# Altium schematic sheet Top_Layer.SchDoc
size A4; SheetNumber: 1; SheetTotal: 10
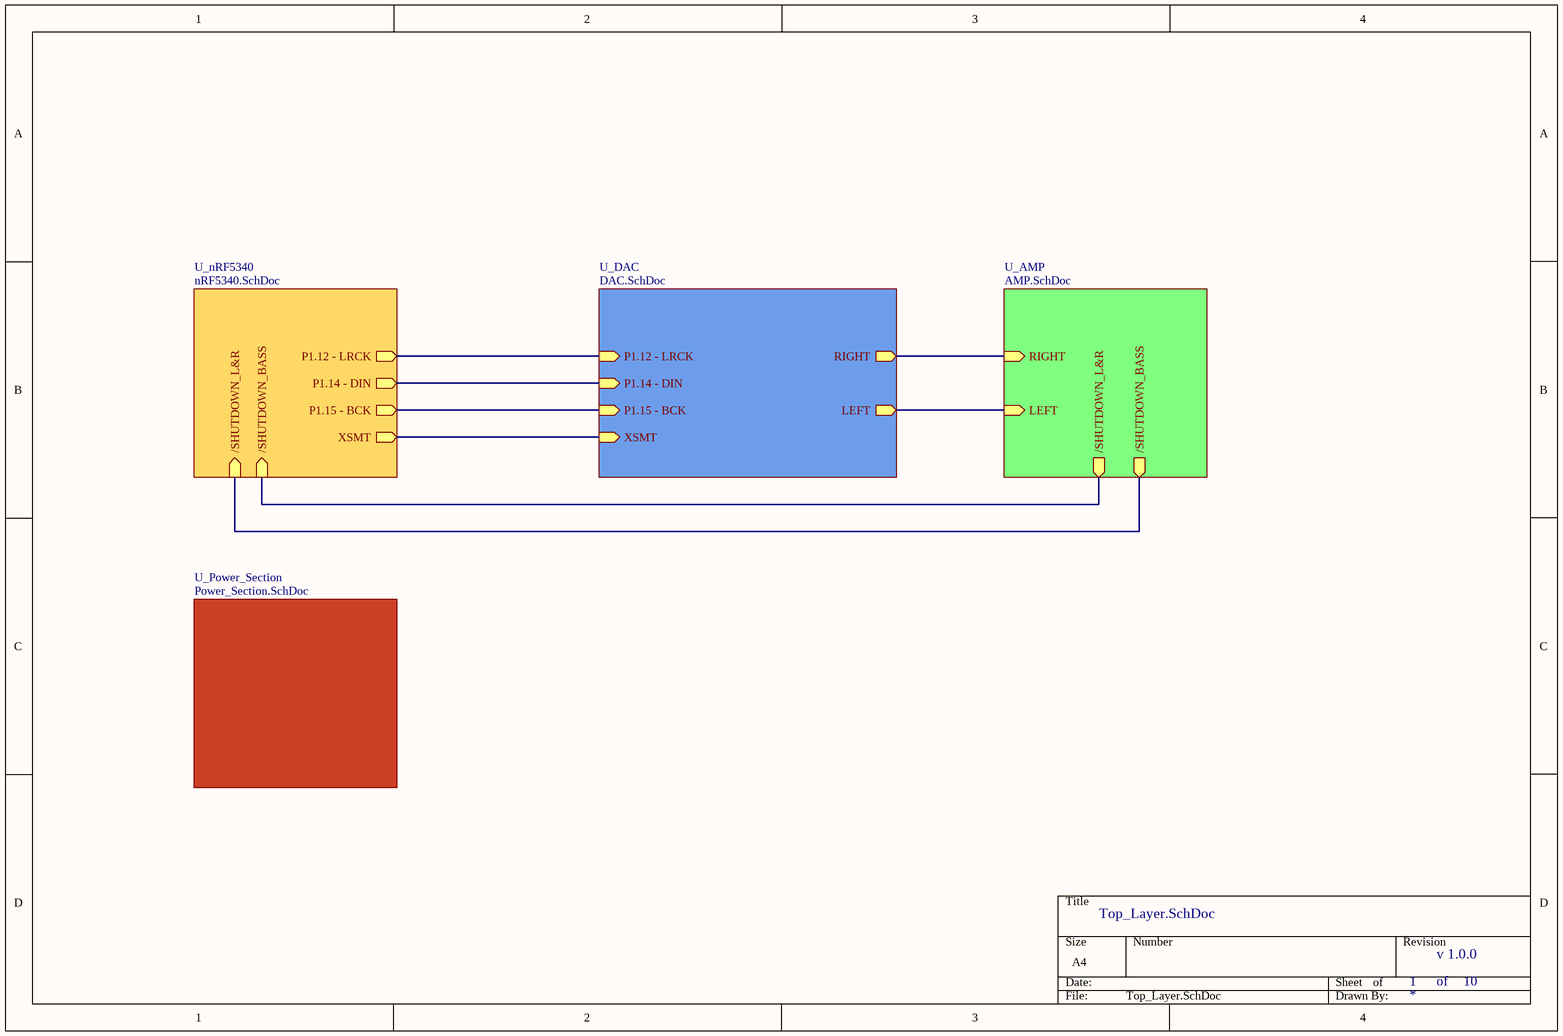
[diagram p0: Top_Layer.SchDoc]

## Sub-sheets
U_AMP = AMP.SchDoc: RIGHT (in), LEFT (in), /SHUTDOWN_L&R (out), /SHUTDOWN_BASS (out)
U_DAC = DAC.SchDoc: P1.15 - BCK (in), P1.14 - DIN (in), P1.12 - LRCK (in), LEFT (out), RIGHT (out), XSMT (in)
U_nRF5340 = nRF5340.SchDoc: P1.12 - LRCK (out), P1.14 - DIN (out), P1.15 - BCK (out), XSMT (out), /SHUTDOWN_L&R (in), /SHUTDOWN_BASS (in)
U_Power_Section = Power_Section.SchDoc: no entries

## Nets
(unnamed): sheet U_nRF5340/P1.12 - LRCK, sheet U_DAC/P1.12 - LRCK
(unnamed): sheet U_nRF5340/P1.14 - DIN, sheet U_DAC/P1.14 - DIN
(unnamed): sheet U_nRF5340/P1.15 - BCK, sheet U_DAC/P1.15 - BCK
(unnamed): sheet U_nRF5340/XSMT, sheet U_DAC/XSMT
(unnamed): sheet U_nRF5340//SHUTDOWN_L&R, sheet U_AMP//SHUTDOWN_BASS
(unnamed): sheet U_nRF5340//SHUTDOWN_BASS, sheet U_AMP//SHUTDOWN_L&R
(unnamed): sheet U_AMP/RIGHT, sheet U_DAC/RIGHT
(unnamed): sheet U_AMP/LEFT, sheet U_DAC/LEFT

## Notes on the sheet
- v 1.0.0
- of